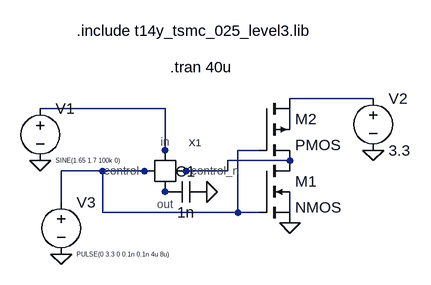
[diagram p0: schematic tg_gate_test.asc]
tg_gate_test.asc, the LTspice schematic file:
Version 4
SHEET 1 880 680
WIRE 496 32 368 32
WIRE 176 48 -16 48
WIRE 368 80 368 48
WIRE 176 112 176 48
WIRE 320 112 288 112
WIRE 176 128 176 112
WIRE 368 128 272 128
WIRE 80 144 16 144
WIRE 144 144 80 144
WIRE 160 144 144 144
WIRE 208 144 192 144
WIRE 272 144 272 128
WIRE 272 144 208 144
WIRE 176 176 176 160
WIRE 16 192 16 144
WIRE 80 208 80 144
WIRE 288 208 288 112
WIRE 288 208 80 208
WIRE 320 208 288 208
WIRE 368 208 368 176
FLAG -16 128 0
FLAG 16 272 0
FLAG 368 224 0
FLAG 496 112 0
FLAG 240 176 0
SYMBOL nmos4 320 128 R0
SYMATTR InstName M1
SYMATTR Value2 l=250n w=10u m=40
SYMBOL pmos4 320 32 R0
SYMATTR InstName M2
SYMATTR Value2 l=250n w=20u m=40
SYMBOL voltage -16 32 R0
WINDOW 3 24 96 Left 0
WINDOW 123 0 0 Left 0
WINDOW 39 0 0 Left 0
SYMATTR Value SINE(1.65 1.7 100k 0)
SYMATTR InstName V1
SYMBOL voltage 496 16 R0
WINDOW 123 0 0 Left 0
WINDOW 39 0 0 Left 0
SYMATTR InstName V2
SYMATTR Value 3.3
SYMBOL voltage 16 176 R0
WINDOW 3 24 96 Left 0
WINDOW 123 0 0 Left 0
WINDOW 39 0 0 Left 0
SYMATTR Value PULSE(0 3.3 0 0.1n 0.1n 4u 8u)
SYMATTR InstName V3
SYMBOL cap 240 160 R90
WINDOW 0 0 32 VBottom 2
WINDOW 3 32 32 VTop 2
SYMATTR InstName C1
SYMATTR Value 1n
SYMBOL tg_gate 176 144 R0
SYMATTR InstName X1
TEXT 40 -72 Left 2 !.include t14y_tsmc_025_level3.lib
TEXT 184 -16 Left 2 !.tran 40u

The netlist it stands for:
* tg_gate_test.asc
M1 N005 N004 0 N007 NMOS l=250n w=10u m=40
M2 N001 N004 N005 N003 PMOS l=250n w=20u m=40
V1 N002 0 SINE(1.65 1.7 100k 0)
V2 N001 0 3.3
V3 N004 0 PULSE(0 3.3 0 0.1n 0.1n 4u 8u)
C1 0 N006 1n
XX1 N002 N006 N004 N005 tg_gate  ; pins in out control control_n
.model NMOS NMOS
.model PMOS PMOS
.lib standard.mos
.include t14y_tsmc_025_level3.lib
.tran 40u
.backanno
.end